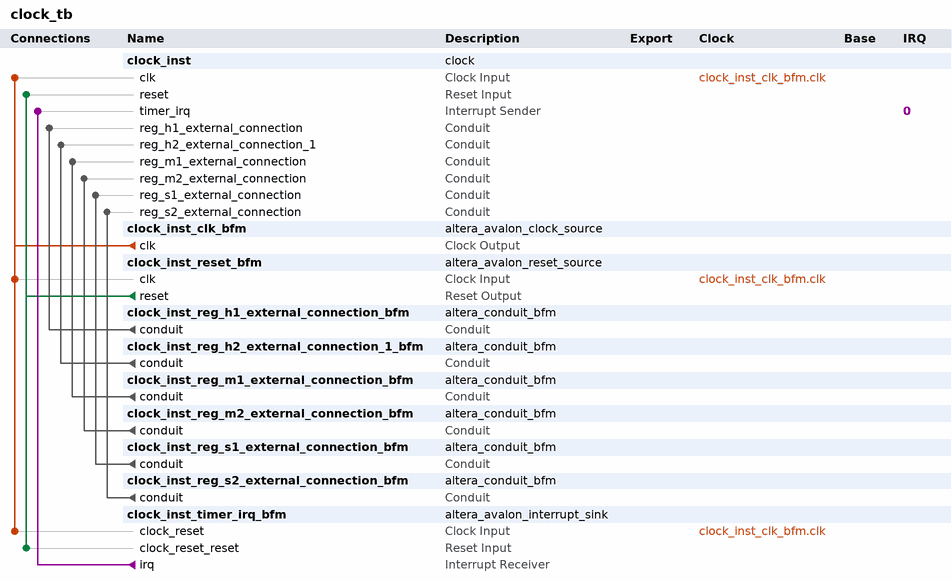
[diagram p0: system contents]
# Platform Designer (Qsys) system clock_tb, Cyclone V 5CSEMA5F31C6
# Parameters at their usual value, and those the tool derives, are not listed.
package require -exact qsys 18.1
create_system clock_tb
set_project_property DEVICE_FAMILY {Cyclone V}
set_project_property DEVICE 5CSEMA5F31C6

add_instance clock_inst clock 1.0

add_instance clock_inst_clk_bfm altera_avalon_clock_source 18.1

add_instance clock_inst_reset_bfm altera_avalon_reset_source 18.1
set_instance_parameter_value clock_inst_reset_bfm ASSERT_HIGH_RESET 0
set_instance_parameter_value clock_inst_reset_bfm INITIAL_RESET_CYCLES 50

add_instance clock_inst_reg_h1_external_connection_bfm altera_conduit_bfm 18.1
set_instance_parameter_value clock_inst_reg_h1_external_connection_bfm CLOCKED_SIGNAL false
set_instance_parameter_value clock_inst_reg_h1_external_connection_bfm ENABLE_RESET false
set_instance_parameter_value clock_inst_reg_h1_external_connection_bfm SIGNAL_DIRECTIONS input
set_instance_parameter_value clock_inst_reg_h1_external_connection_bfm SIGNAL_WIDTHS 8

add_instance clock_inst_reg_h2_external_connection_1_bfm altera_conduit_bfm 18.1
set_instance_parameter_value clock_inst_reg_h2_external_connection_1_bfm CLOCKED_SIGNAL false
set_instance_parameter_value clock_inst_reg_h2_external_connection_1_bfm ENABLE_RESET false
set_instance_parameter_value clock_inst_reg_h2_external_connection_1_bfm SIGNAL_DIRECTIONS input
set_instance_parameter_value clock_inst_reg_h2_external_connection_1_bfm SIGNAL_WIDTHS 8

add_instance clock_inst_reg_m1_external_connection_bfm altera_conduit_bfm 18.1
set_instance_parameter_value clock_inst_reg_m1_external_connection_bfm CLOCKED_SIGNAL false
set_instance_parameter_value clock_inst_reg_m1_external_connection_bfm ENABLE_RESET false
set_instance_parameter_value clock_inst_reg_m1_external_connection_bfm SIGNAL_DIRECTIONS input
set_instance_parameter_value clock_inst_reg_m1_external_connection_bfm SIGNAL_WIDTHS 8

add_instance clock_inst_reg_m2_external_connection_bfm altera_conduit_bfm 18.1
set_instance_parameter_value clock_inst_reg_m2_external_connection_bfm CLOCKED_SIGNAL false
set_instance_parameter_value clock_inst_reg_m2_external_connection_bfm ENABLE_RESET false
set_instance_parameter_value clock_inst_reg_m2_external_connection_bfm SIGNAL_DIRECTIONS input
set_instance_parameter_value clock_inst_reg_m2_external_connection_bfm SIGNAL_WIDTHS 8

add_instance clock_inst_reg_s1_external_connection_bfm altera_conduit_bfm 18.1
set_instance_parameter_value clock_inst_reg_s1_external_connection_bfm CLOCKED_SIGNAL false
set_instance_parameter_value clock_inst_reg_s1_external_connection_bfm ENABLE_RESET false
set_instance_parameter_value clock_inst_reg_s1_external_connection_bfm SIGNAL_DIRECTIONS input
set_instance_parameter_value clock_inst_reg_s1_external_connection_bfm SIGNAL_WIDTHS 8

add_instance clock_inst_reg_s2_external_connection_bfm altera_conduit_bfm 18.1
set_instance_parameter_value clock_inst_reg_s2_external_connection_bfm CLOCKED_SIGNAL false
set_instance_parameter_value clock_inst_reg_s2_external_connection_bfm ENABLE_RESET false
set_instance_parameter_value clock_inst_reg_s2_external_connection_bfm SIGNAL_DIRECTIONS input
set_instance_parameter_value clock_inst_reg_s2_external_connection_bfm SIGNAL_WIDTHS 8

add_instance clock_inst_timer_irq_bfm altera_avalon_interrupt_sink 18.1
set_instance_parameter_value clock_inst_timer_irq_bfm ASSERT_HIGH_IRQ 1
set_instance_parameter_value clock_inst_timer_irq_bfm ASYNCHRONOUS_INTERRUPT 0
set_instance_parameter_value clock_inst_timer_irq_bfm AV_IRQ_W 1
set_instance_parameter_value clock_inst_timer_irq_bfm VHDL_ID 0

# connections
add_connection clock_inst_clk_bfm.clk clock_inst.clk clock
add_connection clock_inst_clk_bfm.clk clock_inst_reset_bfm.clk clock
add_connection clock_inst_clk_bfm.clk clock_inst_timer_irq_bfm.clock_reset clock
add_connection clock_inst_reset_bfm.reset clock_inst.reset reset
add_connection clock_inst_reset_bfm.reset clock_inst_timer_irq_bfm.clock_reset_reset reset
add_connection clock_inst_reg_h1_external_connection_bfm.conduit clock_inst.reg_h1_external_connection conduit
add_connection clock_inst_reg_h2_external_connection_1_bfm.conduit clock_inst.reg_h2_external_connection_1 conduit
add_connection clock_inst_reg_m1_external_connection_bfm.conduit clock_inst.reg_m1_external_connection conduit
add_connection clock_inst_reg_m2_external_connection_bfm.conduit clock_inst.reg_m2_external_connection conduit
add_connection clock_inst_reg_s1_external_connection_bfm.conduit clock_inst.reg_s1_external_connection conduit
add_connection clock_inst_reg_s2_external_connection_bfm.conduit clock_inst.reg_s2_external_connection conduit
add_connection clock_inst_timer_irq_bfm.irq clock_inst.timer_irq interrupt
set_connection_parameter_value clock_inst_timer_irq_bfm.irq/clock_inst.timer_irq irqNumber 0

set_interconnect_requirement {$system} qsys_mm.clockCrossingAdapter HANDSHAKE
set_interconnect_requirement {$system} qsys_mm.enableEccProtection FALSE
set_interconnect_requirement {$system} qsys_mm.insertDefaultSlave FALSE
set_interconnect_requirement {$system} qsys_mm.maxAdditionalLatency 1

save_system clock_tb.qsys
